# EAGLE design SocikPI (EAGLE 8.6.3)
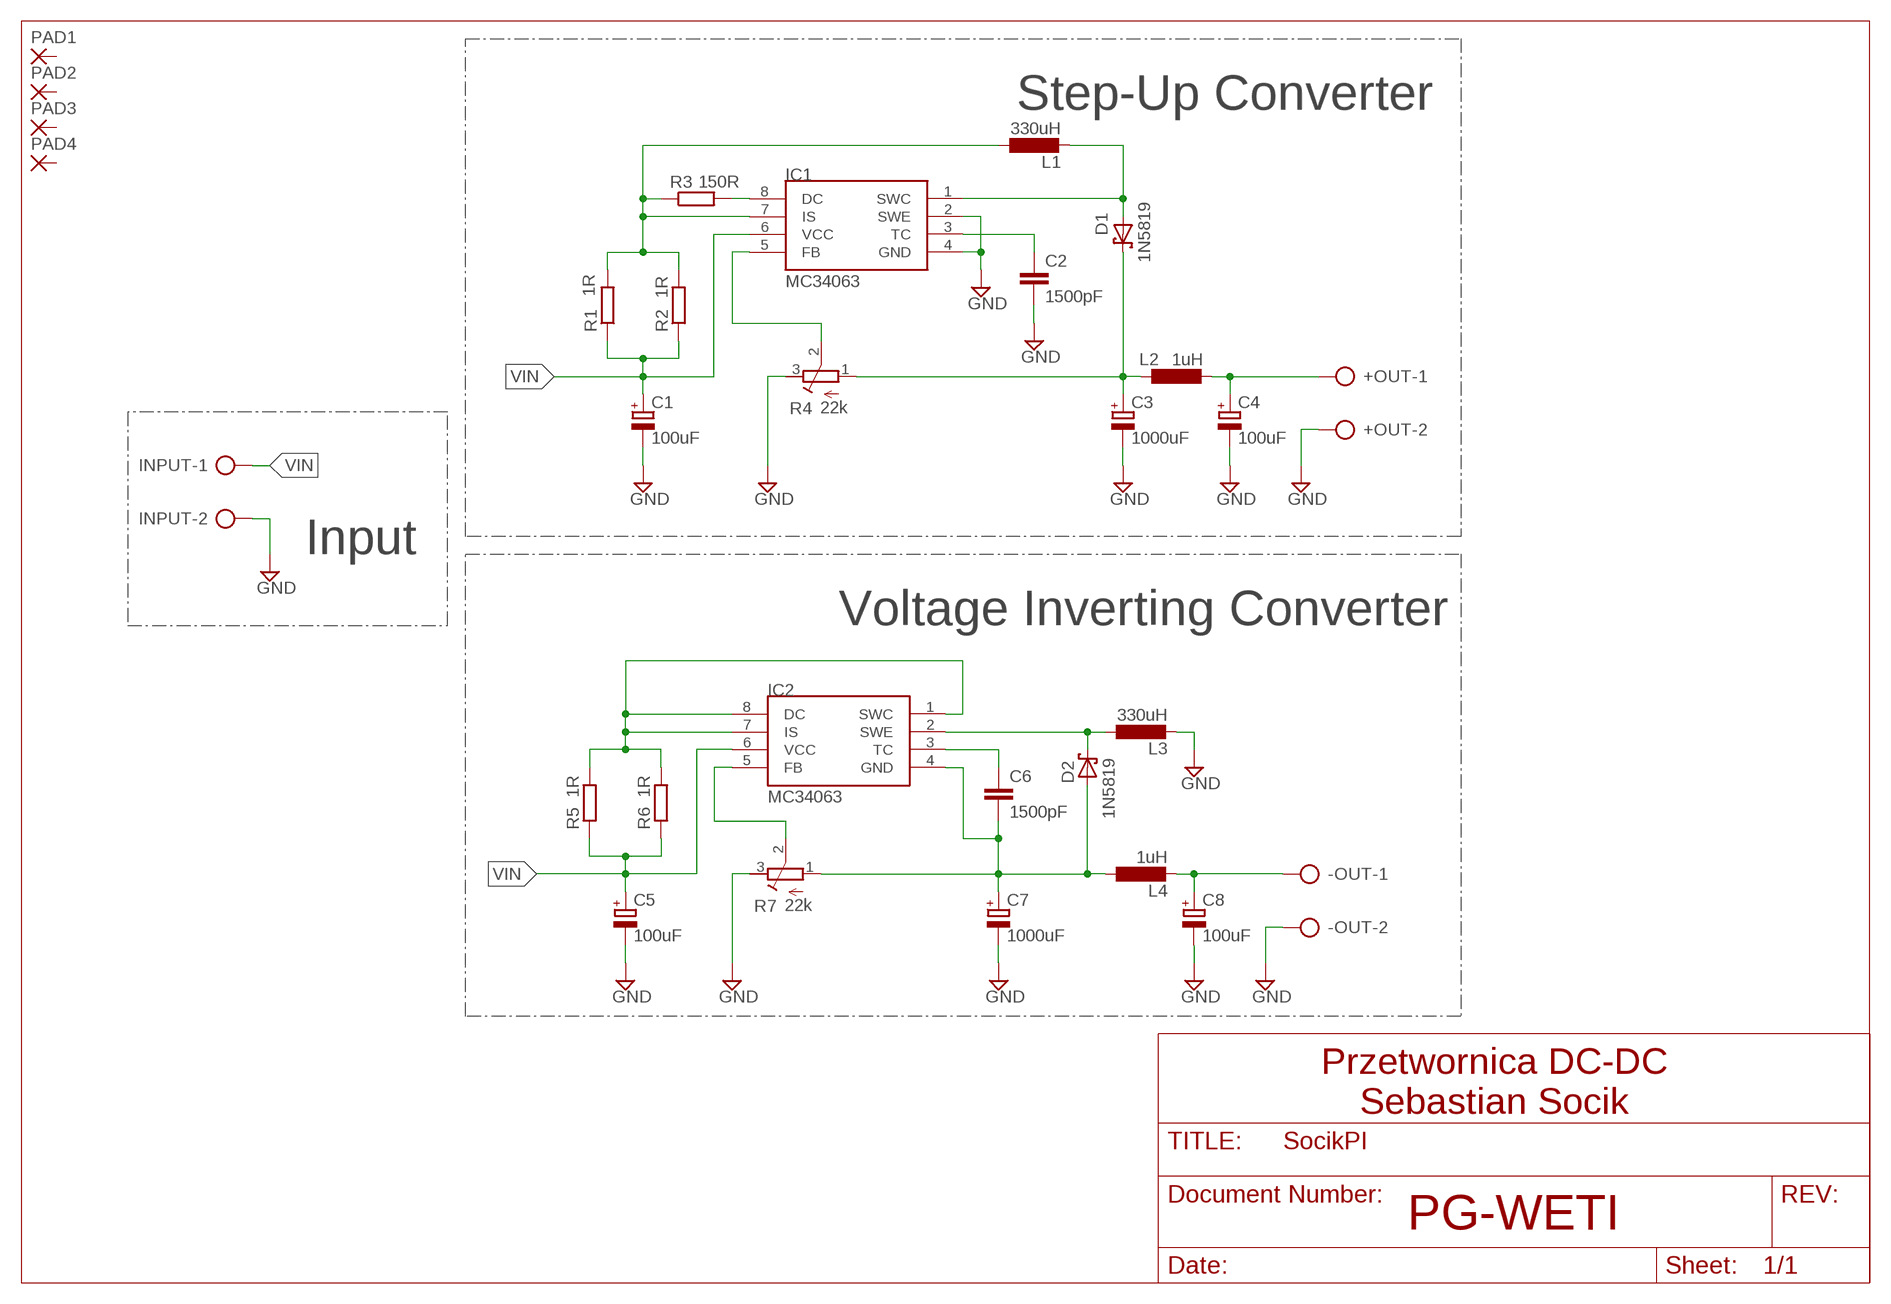
[diagram p0: schematic, sheet 1]

## Parts
+OUT  CON-PTR500_AK500/2  [CON-PTR500_AK500/2]
-OUT  CON-PTR500_AK500/2  [CON-PTR500_AK500/2]
C1  100uF  RCL_CPOL-EUE2.5-7  [RCL_E2,5-7]
C2  1500pF  C-EUC1206  [C1206]
C3  1000uF  RCL_CPOL-EUE5-10.5  [RCL_E5-10,5]
C4  100uF  RCL_CPOL-EUE2.5-7  [RCL_E2,5-7]
C5  100uF  RCL_CPOL-EUE2.5-7  [RCL_E2,5-7]
C6  1500pF  C-EUC1206  [C1206]
C7  1000uF  RCL_CPOL-EUE5-10.5  [RCL_E5-10,5]
C8  100uF  RCL_CPOL-EUE2.5-7  [RCL_E2,5-7]
D1  1N5819  DIODE_1N5819-B  [DIODE_DO41-7.6]
D2  1N5819  DIODE_1N5819-B  [DIODE_DO41-7.6]
IC1  MC34063  MC34063_MC34063AP  [MC34063_DIL08]
IC2  MC34063  MC34063_MC34063AP  [MC34063_DIL08]
INPUT  CON-PTR500_AK500/2  [CON-PTR500_AK500/2]
L1  330uH  RCL_L-EU0207/10  [RCL_0207/10]
L2  1uH  RCL_L-EU0207/10  [RCL_0207/10]
L3  330uH  RCL_L-EU0207/10  [RCL_0207/10]
L4  1uH  RCL_L-EU0207/10  [RCL_0207/10]
PAD1  2,54/1,1  [2,54/1,1]
PAD2  2,54/1,1  [2,54/1,1]
PAD3  2,54/1,1  [2,54/1,1]
PAD4  2,54/1,1  [2,54/1,1]
R1  1R  R-EU_R1206  [R1206]
R2  1R  R-EU_R1206  [R1206]
R3  150R  R-EU_R1206  [R1206]
R4  22k  PRZETWORNICAL_RTRIMCT32  [PRZETWORNICAL_RTRIMCT32]
R5  1R  R-EU_R1206  [R1206]
R6  1R  R-EU_R1206  [R1206]
R7  22k  PRZETWORNICAL_RTRIMCT32  [PRZETWORNICAL_RTRIMCT32]

## Nets
GND: +OUT.2 -OUT.2 C1.- C2.2 C3.- C4.- C5.- C7.- C8.- IC1.2(SWE) IC1.4(GND) INPUT.2 L3.2 R4.3(E) R7.3(E)
N$1: C2.1 IC1.3(TC)
N$2: IC1.8(DC) R3.2
N$3: IC1.7(IS) L1.1 R1.2 R2.2 R3.1
N$4: D1.A IC1.1(SWC) L1.2
N$5: IC1.5(FB) R4.2(S)
N$6: C3.+ D1.C L2.1 R4.1(A)
N$7: +OUT.1 C4.+ L2.2
N$8: IC2.1(SWC) IC2.7(IS) IC2.8(DC) R5.2 R6.2
N$11: C6.1 IC2.3(TC)
N$12: C6.2 C7.+ D2.A IC2.4(GND) L4.1 R7.1(A)
N$13: IC2.5(FB) R7.2(S)
N$14: -OUT.1 C8.+ L4.2
N$16: D2.C IC2.2(SWE) L3.1
VIN: C1.+ C5.+ IC1.6(VCC) IC2.6(VCC) INPUT.1 R1.1 R2.1 R5.1 R6.1
Unconnected: PAD1.1(P) PAD2.1(P) PAD3.1(P) PAD4.1(P)

## Notes on the sheet
- Step-Up Converter
- Input
- Voltage Inverting Converter
- Przetwornica DC-DC
  Sebastian Socik
- PG-WETI

## Library data of the parts
+OUT -OUT INPUT = zmienionePady:CON-PTR500_AK500/2: CONNECTOR; OC_FARNELL: unknown; OC_NEWARK: unknown
C1 C3-C5 C7 C8 = zmienionePady:RCL_CPOL-EU: POLARIZED CAPACITOR, European symbol; SPICEPREFIX: C
C2 C6 = rcl:C-EU: CAPACITOR, European symbol
D1 D2 = zmienionePady:DIODE_1N581*: 1.0A SCHOTTKY BARRIER RECTIFIER Source: http://www.diodes.com/datasheets/ds23001.pdf
IC1 IC2 = zmienionePady:MC34063_MC34063
L1-L4 = zmienionePady:RCL_L-EU: INDUCTOR, European symbol; SPICEPREFIX: L
PAD1-PAD4 = wirepad:2,54/1,1: THROUGH-HOLE PAD
R1-R3 R5 R6 = rcl:R-EU_: RESISTOR, European symbol
R4 R7 = zmienionePady:PRZETWORNICAL_RTRIM

## Board
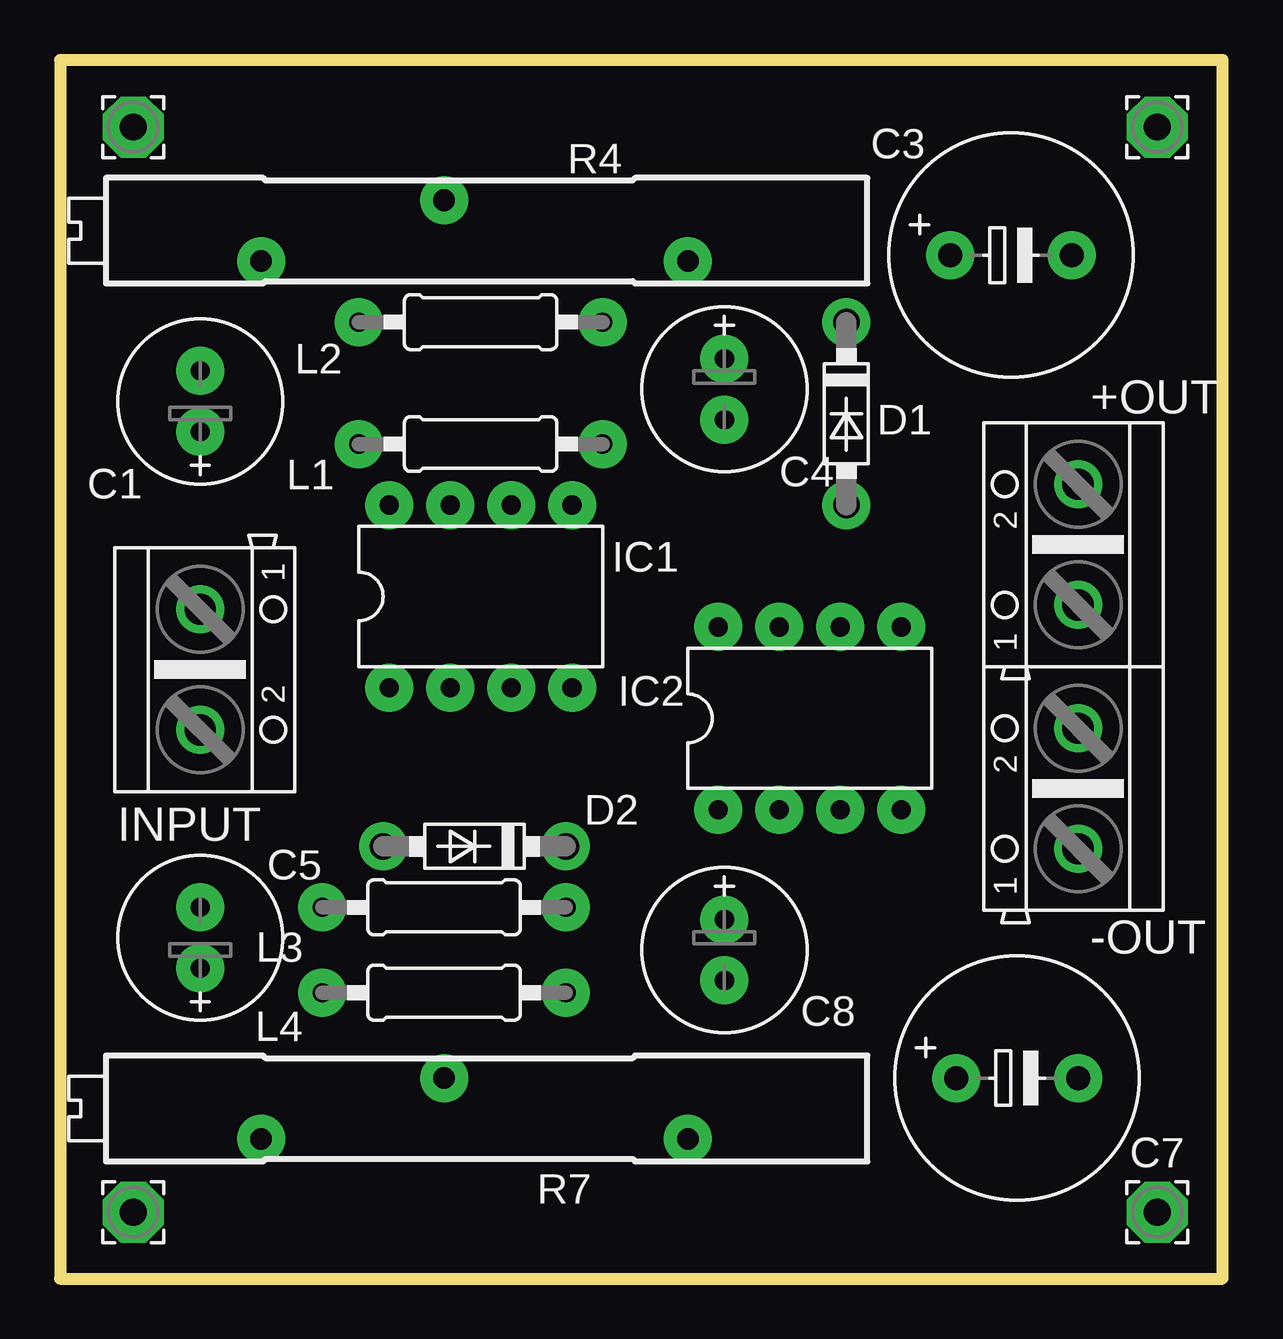
[diagram p1: board, top side]
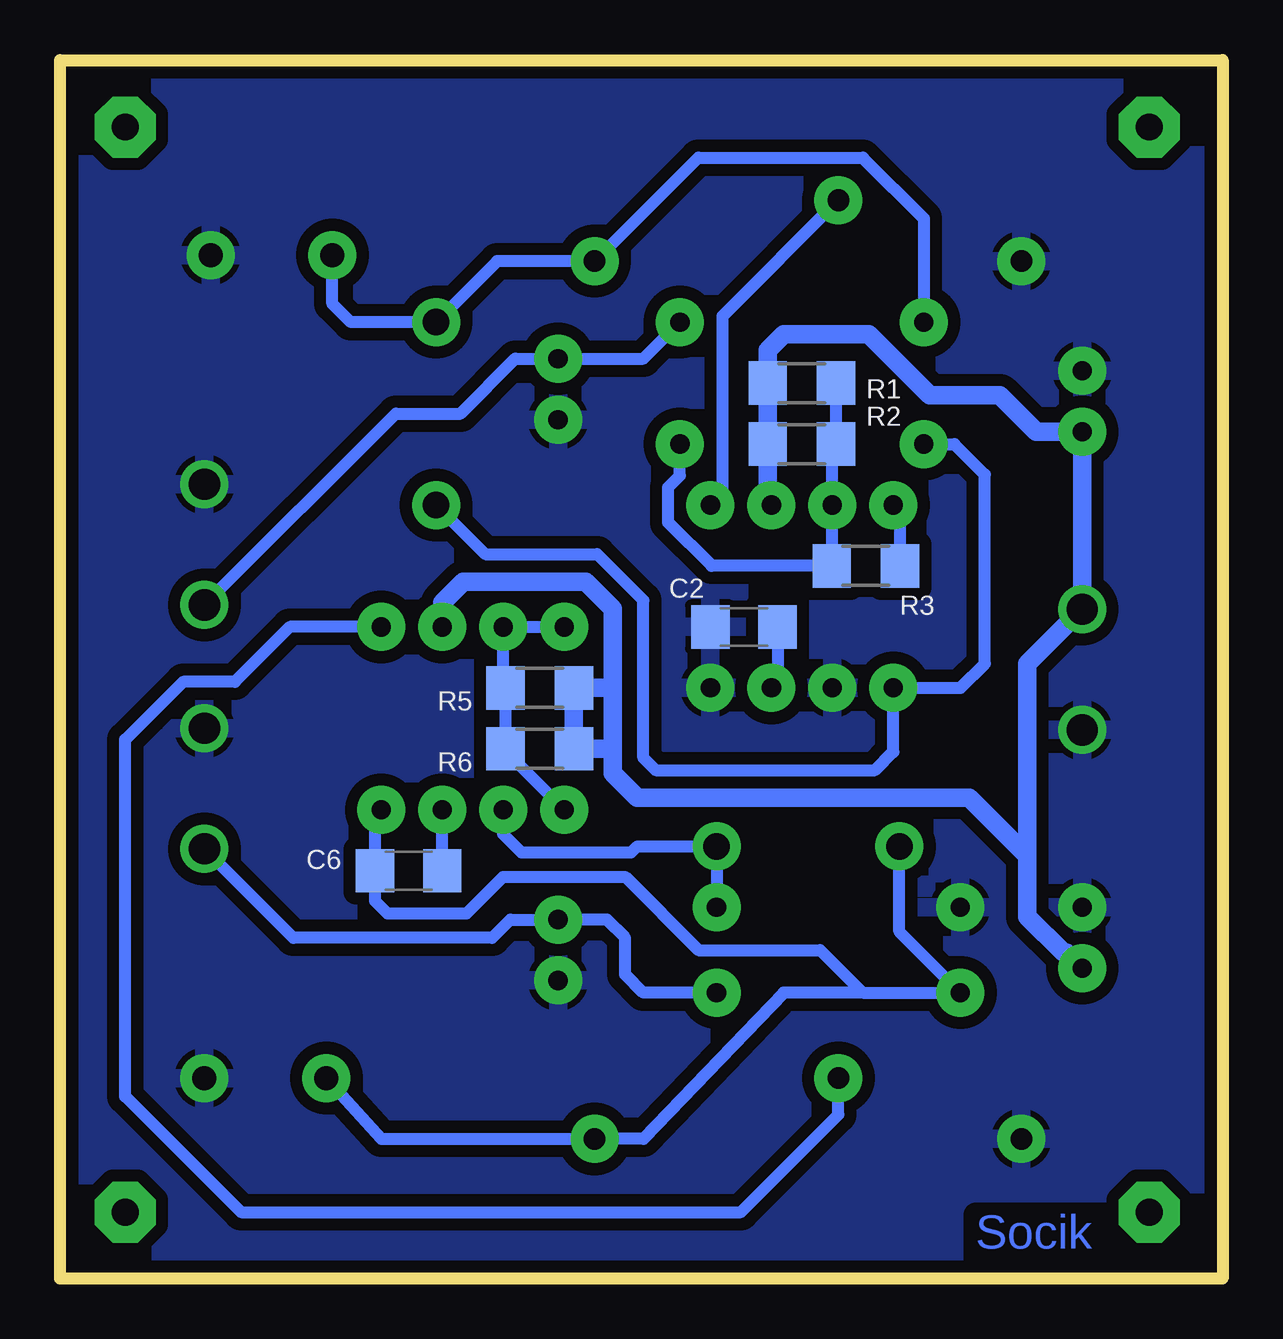
[diagram p2: board, bottom side, seen from below]

Size 48.44 x 50.78 mm. Coordinates in mm from the lower left corner, seen from the top.
Outline: 0,50.78 0,0 48.44,0 48.44,50.78 0,50.78
Copper layers (1*16): Top 0.035mm / dielectric 1.5mm / Bottom 0.035mm
Design rules "default *": minimum track width 20mil, minimum drill 0.35mm, track to track 20mil, track to pad 20mil, pad to pad 20mil, via to via 20mil, smd to smd 6mil, copper to edge 20mil, drill to drill 6mil, minimum pad ring 10mil, minimum via ring 8mil, stop-mask expansion 4mil, vias tented up to drill 0mil, thermal gap 10mil

### Footprints (pad centres in the part's own frame; a part is rotated, then mirrored left to right if it is on the bottom)
CON-PTR500_AK500/2 = drill 1.3 pad 2: 1 -2.515,0; 2 2.515,0
RCL_E2,5-7 = drill 0.8 pad 2: + -1.27,0; - 1.27,0
C1206 = smd 1.6 x 1.8: 1 -1.4,0; 2 1.4,0
RCL_E5-10,5 = drill 1 pad 2: + -2.54,0; - 2.54,0
DIODE_DO41-7.6 = drill 1.1 pad 2: A 3.81,0; C -3.81,0
MC34063_DIL08 = drill 0.8 pad 2: 1 -3.81,-3.81; 2 -1.27,-3.81; 3 1.27,-3.81; 4 3.81,-3.81; 5 3.81,3.81; 6 1.27,3.81; 7 -1.27,3.81; 8 -3.81,3.81
RCL_0207/10 = drill 0.8 pad 2: 1 -5.08,0; 2 5.08,0
2,54/1,1 = drill 1.118 pad 2.54 octagon: 1 0,0
R1206 = smd 1.6 x 1.803: 1 -1.422,0; 2 1.422,0
PRZETWORNICAL_RTRIMCT32 = drill 0.9 pad 2: 1 -8.89,1.27; 2 1.27,-1.27; 3 8.89,1.27

### Placement (x,y rotation side)
+OUT  42.42,30.59 90 top
-OUT  42.42,20.43 90 top
C1  5.84,36.56 90 top
C2  19.94,27.16 180 bottom
C3  39.62,42.65 0 top
C4  27.69,37.06 270 top
C5  5.84,14.2 90 top
C6  33.91,17 180 bottom
C7  39.88,8.36 0 top
C8  27.69,13.7 270 top
D1  32.77,36.05 270 top
D2  17.27,18.01 180 top
IC1  17.53,28.43 0 top
IC2  31.24,23.35 0 top
INPUT  5.84,25.38 270 top
L1  17.53,34.78 180 top
L2  17.53,39.86 0 top
L3  16,15.47 180 top
L4  16,11.92 0 top
PAD1  3.05,47.99 0 top
PAD2  45.72,47.99 0 top
PAD3  3.05,2.77 0 top
PAD4  45.72,2.77 0 top
R1  17.53,37.32 0 bottom
R2  17.53,34.78 0 bottom
R3  14.86,29.7 0 bottom
R4  17.27,43.67 180 top
R5  28.45,24.62 180 bottom
R6  28.45,22.08 180 bottom
R7  17.27,7.09 180 top

### Tracks (layer width: path | path; a pad name or v marks a point on that pad's centre or on a via)
GND
  pour Bottom (isolate 0.508): -1.02,50.78 -1.02,-0.02 48.51,-0.02 48.51,50.78
N$1
  Bottom 0.508: C2.1 18.54,24.87 IC1.3
N$2
  Bottom 0.508: R3.2 13.44,31.96 IC1.8
N$3
  Bottom 0.508: R1.2 R2.2 16.26,34.63 IC1.7 16.28,32.21 R3.1 21.29,29.7 23.1,31.51 23.1,32.97 22.61,33.46 L1.1
N$4
  Bottom 0.508: D1.A 30.72,30.19 26.05,30.19 24.13,28.27 24.13,21.7 23.62,21.19 14.48,21.19 13.72,21.95 IC1.1 10.92,24.62 9.91,25.63 9.91,33.51 11.18,34.78 L1.2
N$5
  Bottom 0.508: R4.2 20.83,40.11 20.83,32.75 IC1.5
N$6
  Bottom 0.508: C3.+ 37.08,40.62 36.32,39.86 D1.C 30.23,42.4 R4.1 21.84,46.72 14.99,46.72 12.45,44.18 L2.1
N$7
  Bottom 0.508: +OUT.1 34.44,36.05 31.75,36.05 29.46,38.33 C4.+ 24.13,38.33 L2.2
N$8
  Bottom 0.508: R6.2 R5.2 29.97,24.72 IC2.7 IC2.8 | 29.97,22.08 R6.2 | IC2.1 29.87,21.98 R6.2
N$11
  Bottom 0.508: C6.1 IC2.3
N$12
  Bottom 0.508: 14.99,11.92 L4.1 13.46,14.46 D2.A | 14.99,11.92 16.76,13.7 21.84,13.7 24.89,16.74 29.97,16.74 31.5,15.22 34.8,15.22 35.31,15.73 C6.2 35.31,19.28 IC2.4 | 14.99,11.92 18.29,11.92 24.13,5.82 R7.1 35.05,5.82 C7.+
N$13
  Bottom 0.508: R7.2 16,6.84 20.07,2.77 40.89,2.77 45.72,7.6 45.72,22.46 43.31,24.87 41.15,24.87 38.86,27.16 IC2.5
N$14
  Bottom 0.508: L4.2 24.13,11.92 24.89,12.68 24.89,14.2 25.65,14.97 C8.+ 29.67,14.97 30.43,14.2 38.71,14.2 -OUT.1
N$16
  Bottom 0.508: L3.1 D2.C 24.38,18.01 24.64,17.76 29.21,17.76 29.97,18.52 IC2.2
VIN
  Bottom 0.762: IC1.6 18.95,32.39 R2.1 R1.1 18.95,38.69 18.29,39.35 14.73,39.35 12.19,36.81 9.28,36.81 7.75,35.29 C1.+ INPUT.1 5.87,27.89 8.13,25.63 8.13,17.63 | IC2.6 32.51,28.17 31.64,29.05 26.53,29.05 25.4,27.92 25.4,24.62 | 25.4,22.08 25.4,21.06 24.38,20.05 10.55,20.05 8.13,17.63 | 25.4,22.08 25.4,24.62 | 25.4,22.08 R6.1 R5.1 25.4,24.62 | C5.+ 6.49,13.58 6.62,13.58 8.13,15.09 8.13,17.63

### Text on the board
Bottom: Socik
tTest: Przetwornica DC-DC